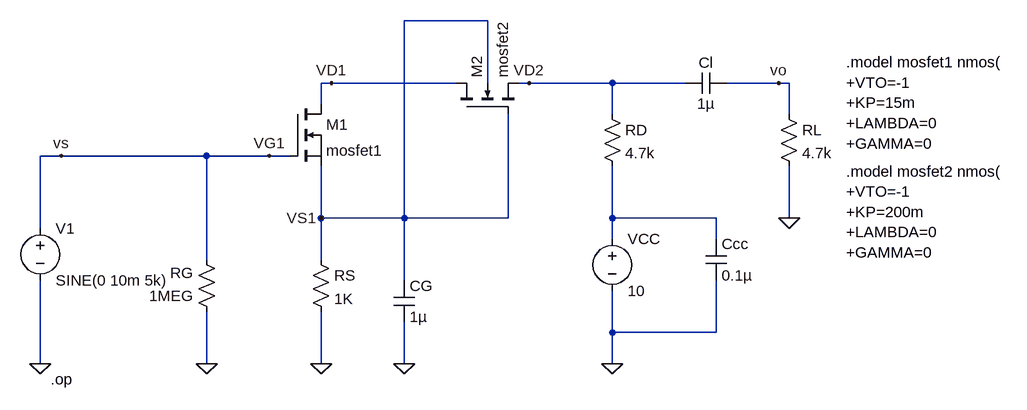
[diagram p0: schematic continua.asc]
continua.asc, the LTspice schematic file:
Version 4
SHEET 1 2100 680
WIRE 464 -176 336 -176
WIRE 224 -80 208 -80
WIRE 416 -80 224 -80
WIRE 464 -80 464 -176
WIRE 528 -80 512 -80
WIRE 656 -80 528 -80
WIRE 768 -80 656 -80
WIRE 912 -80 832 -80
WIRE 928 -80 912 -80
WIRE 208 -48 208 -80
WIRE 656 -32 656 -80
WIRE 928 -32 928 -80
WIRE -192 32 -224 32
WIRE 32 32 -192 32
WIRE 128 32 32 32
WIRE 160 32 128 32
WIRE 208 128 208 48
WIRE 336 128 336 -176
WIRE 336 128 208 128
WIRE 496 128 496 -32
WIRE 496 128 336 128
WIRE 656 128 656 48
WIRE 816 128 656 128
WIRE 928 128 928 48
WIRE -224 144 -224 32
WIRE 656 160 656 128
WIRE 816 160 816 128
WIRE 32 192 32 32
WIRE 208 192 208 128
WIRE 336 224 336 128
WIRE 656 304 656 240
WIRE 816 304 816 224
WIRE 816 304 656 304
WIRE -224 352 -224 224
WIRE 32 352 32 272
WIRE 208 352 208 272
WIRE 336 352 336 288
WIRE 656 352 656 304
FLAG 32 352 0
FLAG 208 352 0
FLAG 656 352 0
FLAG 336 352 0
FLAG 928 128 0
FLAG 912 -80 vo
FLAG 128 32 VG1
FLAG 224 -80 VD1
FLAG 528 -80 VD2
FLAG 208 128 VS1
FLAG -224 352 0
FLAG -192 32 vs
SYMBOL res 48 288 R180
WINDOW 0 36 76 Left 2
WINDOW 3 36 40 Left 2
SYMATTR InstName RG
SYMATTR Value 1MEG
SYMBOL res 192 176 R0
SYMATTR InstName RS
SYMATTR Value 1K
SYMBOL nmos4 416 -32 R270
SYMATTR InstName M2
SYMATTR Value mosfet2
SYMBOL res 640 -48 R0
SYMATTR InstName RD
SYMATTR Value 4.7k
SYMBOL voltage 656 144 R0
SYMATTR InstName VCC
SYMATTR Value 10
SYMBOL nmos 160 -48 R0
SYMATTR InstName M1
SYMATTR Value mosfet1
SYMBOL cap 320 224 R0
SYMATTR InstName CG
SYMATTR Value 1µ
SYMBOL cap 800 160 R0
SYMATTR InstName Ccc
SYMATTR Value 0.1µ
SYMBOL cap 832 -96 R90
WINDOW 0 0 32 VBottom 2
WINDOW 3 32 32 VTop 2
SYMATTR InstName Cl
SYMATTR Value 1µ
SYMBOL res 912 -48 R0
SYMATTR InstName RL
SYMATTR Value 4.7k
SYMBOL voltage -224 128 R0
WINDOW 123 0 0 Left 2
WINDOW 39 0 0 Left 2
SYMATTR InstName V1
SYMATTR Value SINE(0 10m 5k)
TEXT -208 376 Left 2 !.op
TEXT 1016 -112 Left 2 !.model mosfet1 nmos( \n+VTO=-1 \n+KP=15m \n+LAMBDA=0 \n+GAMMA=0
TEXT 1016 56 Left 2 !.model mosfet2 nmos( \n+VTO=-1 \n+KP=200m \n+LAMBDA=0 \n+GAMMA=0

The netlist it stands for:
* continua.asc
RG 0 vs 1MEG
RS VS1 0 1K
M2 VD1 VS1 VD2 VS1 mosfet2
RD VD2 N001 4.7k
VCC N001 0 10
M1 VD1 vs VS1 VS1 mosfet1
CG VS1 0 1µ
Ccc N001 0 0.1µ
Cl vo VD2 1µ
RL vo 0 4.7k
V1 vs 0 SINE(0 10m 5k)
.model NMOS NMOS
.model PMOS PMOS
.lib standard.mos
.op
.model mosfet1 nmos(
+VTO=-1
+KP=15m
+LAMBDA=0
+GAMMA=0
.model mosfet2 nmos(
+VTO=-1
+KP=200m
+LAMBDA=0
+GAMMA=0
.backanno
.end